# Altium schematic sheet PowerSupply.SchDoc
size A3
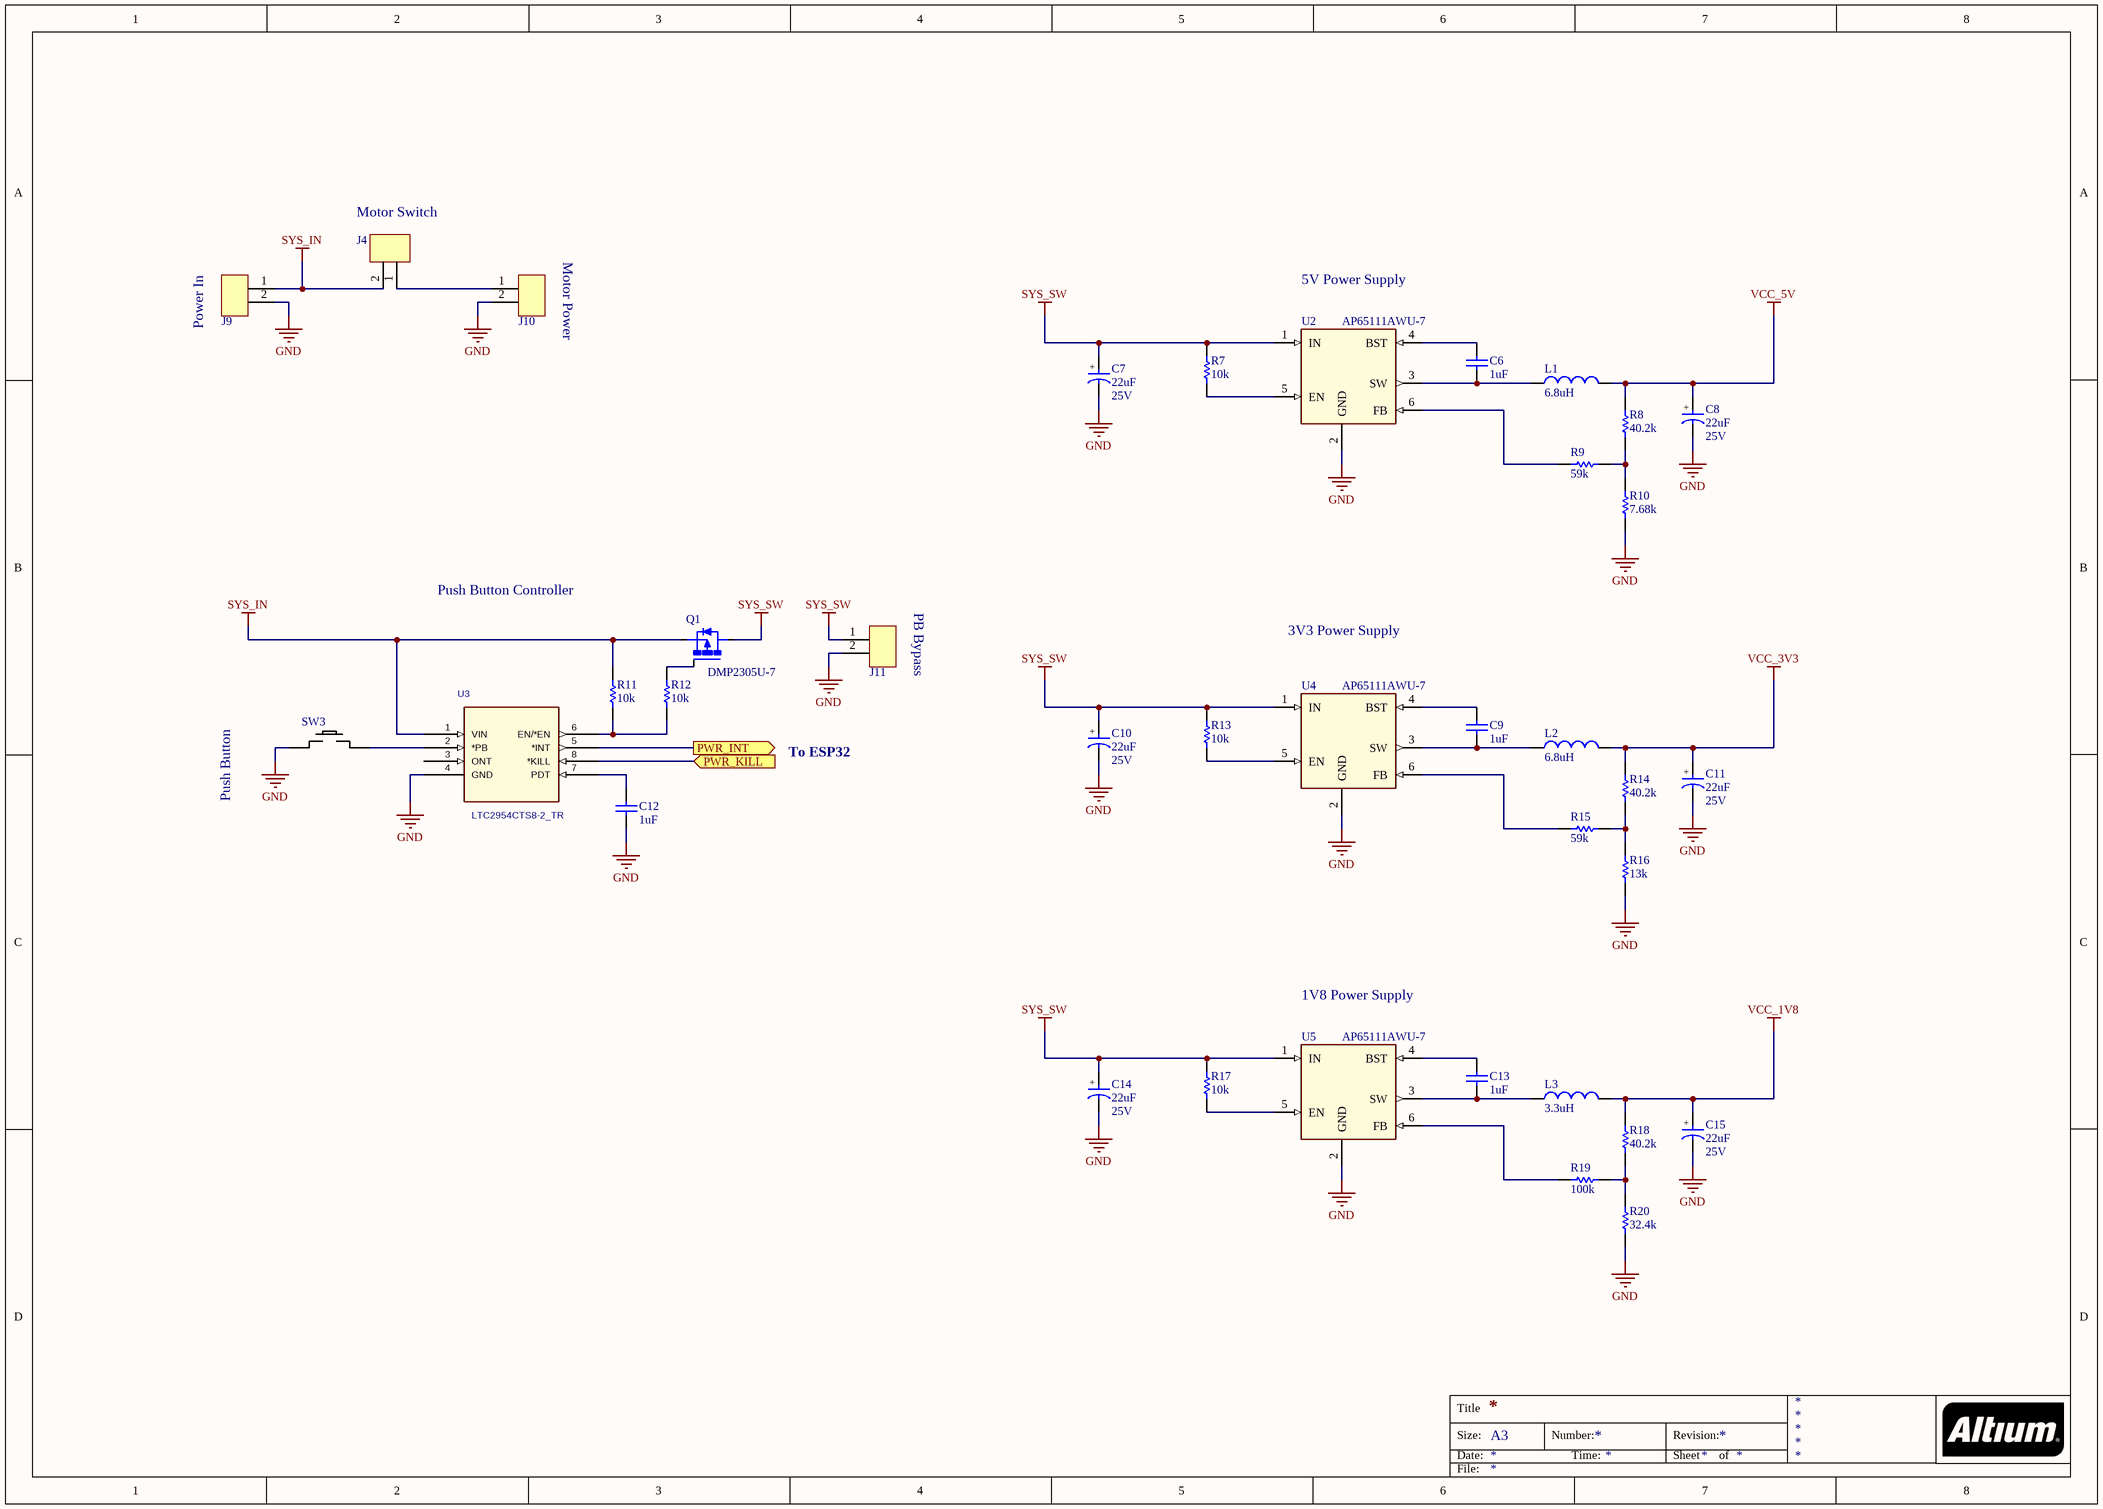
[diagram p0: PowerSupply.SchDoc]

## Parts
C6  value 1uF  [C0603]  (hidden comment: CAP)
C7  value 22uF  Voltage: 25V  [CASE-A]  (hidden comment: CAP-P)
C8  value 22uF  Voltage: 25V  [CASE-A]  (hidden comment: CAP-P)
C9  value 1uF  [C0603]  (hidden comment: CAP)
C10  value 22uF  Voltage: 25V  [CASE-A]  (hidden comment: CAP-P)
C11  value 22uF  Voltage: 25V  [CASE-A]  (hidden comment: CAP-P)
C12  value 1uF  [C0603]  (hidden comment: CAP)
C13  value 1uF  [C0603]  (hidden comment: CAP)
C14  value 22uF  Voltage: 25V  [CASE-A]  (hidden comment: CAP-P)
C15  value 22uF  Voltage: 25V  [CASE-A]  (hidden comment: CAP-P)
J4  HDR_1x2  [PINHEAD_2.00mm_1x2]  (value not drawn)
J9  HDR_1x2  [PINHEAD_2.00mm_1x2]  (value not drawn)
J10  HDR_1x2  [PINHEAD_2.00mm_1x2]  (value not drawn)
J11  HDR_1x2  [PINHEAD_2.00mm_1x2]  (value not drawn)
L1  value 6.8uH  [PA4332.XXXNLT]  (hidden comment: PA4332.103NLT)
L2  value 6.8uH  [PA4332.XXXNLT]  (hidden comment: PA4332.103NLT)
L3  value 3.3uH  [PA4332.XXXNLT]  (hidden comment: PA4332.103NLT)
Q1  DMP2305U-7  [SOT23-3]
R7  value 10k  [R0603]  (hidden comment: RES)
R8  value 40.2k  [R0603]  (hidden comment: RES)
R9  value 59k  [R0603]  (hidden comment: RES)
R10  value 7.68k  [R0603]  (hidden comment: RES)
R11  value 10k  [R0603]  (hidden comment: RES)
R12  value 10k  [R0603]  (hidden comment: RES)
R13  value 10k  [R0603]  (hidden comment: RES)
R14  value 40.2k  [R0603]  (hidden comment: RES)
R15  value 59k  [R0603]  (hidden comment: RES)
R16  value 13k  [R0603]  (hidden comment: RES)
R17  value 10k  [R0603]  (hidden comment: RES)
R18  value 40.2k  [R0603]  (hidden comment: RES)
R19  value 100k  [R0603]  (hidden comment: RES)
R20  value 32.4k  [R0603]  (hidden comment: RES)
SW3  TACTILE_BUTTON  [TACTILE_BUTTOn]  (value not drawn)
U2  AP65111AWU-7  [SOT95P280X100-6N]
U3  LTC2954CTS8-2_TR  [TSOT-23_TS8-M]
U4  AP65111AWU-7  [SOT95P280X100-6N]
U5  AP65111AWU-7  [SOT95P280X100-6N]

## Ports
PWR_INT (out), PWR_KILL (in)

## Nets
GND: C7.2 C8.2 C10.2 C11.2 C12.2 C14.2 C15.2 J9.2 J10.2 J11.2 R10.2 R16.2 R20.2 SW3.1 U2.2(GND) U3.4(GND) U4.2(GND) U5.2(GND)
SYS_IN: J4.2 J9.1 Q1.2(S) R11.2 U3.1(VIN)
SYS_SW: C7.1 C10.1 C14.1 J11.1 Q1.3(D) R7.1 R13.1 R17.1 U2.1(IN) U4.1(IN) U5.1(IN)
VCC_1V8: C15.1 L3.2 R18.1
VCC_3V3: C11.1 L2.2 R14.1
VCC_5V: C8.1 L1.2 R8.1
PWR_INT: U3.5(*INT) ; port PWR_INT
PWR_KILL: U3.8(*KILL) ; port PWR_KILL
NetC6_1: C6.1 U2.4(BST)
NetC6_2: C6.2 L1.1 U2.3(SW)
NetC9_1: C9.1 U4.4(BST)
NetC9_2: C9.2 L2.1 U4.3(SW)
NetC12_1: C12.1 U3.7(PDT)
NetC13_1: C13.1 U5.4(BST)
NetC13_2: C13.2 L3.1 U5.3(SW)
NetJ4_1: J4.1 J10.1
NetQ1_1: Q1.1(G) R12.2
NetR7_2: R7.2 U2.5(EN)
NetR8_2: R8.2 R9.2 R10.1
NetR9_1: R9.1 U2.6(FB)
NetR11_1: R11.1 R12.1 U3.6(EN/*EN)
NetR13_2: R13.2 U4.5(EN)
NetR14_2: R14.2 R15.2 R16.1
NetR15_1: R15.1 U4.6(FB)
NetR17_2: R17.2 U5.5(EN)
NetR18_2: R18.2 R19.2 R20.1
NetR19_1: R19.1 U5.6(FB)
NetSW3_2: SW3.2 U3.2(*PB)

Not connected (* = marked no-connect by the designer): U3 3(ONT)

## Notes on the sheet
- (near J4) Motor Switch
- (near J10) Motor Power
- 5V Power Supply
- (near J9) Power In
- Push Button Controller
- (near J11) PB Bypass
- 3V3 Power Supply
- To ESP32
- Push Button
- 1V8 Power Supply
- Title
- Size:
- Date:
- A3
- Number:
- Time:
- Revision:
- Sheet
- of
- File:
- (in symbol CAP-P) +

## Library data of the parts
C6 C9 C12 C13 = CAP: =Description; Voltage: 25V
C7 C8 C10 C11 C14 C15 = CAP-P: =Description
J4 J9-J11 = HDR_1x2: =Description
L1 L2 = IND: =Description; Part_Number: PA4332.682NLT
L3 = IND: FIXED IND 10UH 2A 216 MOHM SMD; Part_Number: PA4332.332NLT
Q1 = MOSFET_P_GSD: P Channel MOSFET, SOT23; Part_Number: DMP2305U-7
R7-R20 = RES: =Description
U2 U4 U5 = AP65111AWU-7: Dcdc Conv Hv Buck Tsot26 t&r 3k; MF: Diodes Inc.; Digi-Key_Purchase_URL: https://www.digikey.com.au/product-detail/en/diodes-incorporated/AP65111AWU-7/AP65111AWU-7DICT-ND/7652826?utm_source=snapeda&utm_medium=aggregator&utm_campaign=symbol; MP: AP65111AWU-7; Package: TSOT-23-6 Diodes Inc.; SnapEDA_Link: https://www.snapeda.com/parts/AP65111AWU-7/Diodes%20Inc./view-part/?ref=snap; Digi-Key_Part_Number: AP65111AWU-7DICT-ND; Value: *; Part_Number: AP65111AWU-7
U3 = LTC2954CTS8-2_TR: Part_Number: LTC2954CTS8-2#TRMPBF; Vendor: Linear Technology; Built_By: EMA_UL_Team; Value: LTC2954CTS8-2_TR